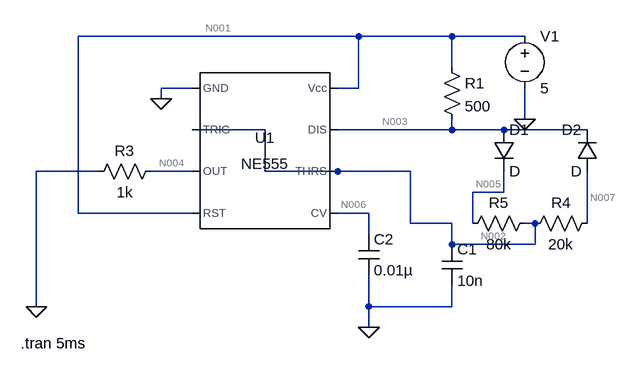
[diagram p0: schematic 555_sim.asc]
555_sim.asc, the LTspice schematic file:
Version 4
SHEET 1 880 680
WIRE 336 0 -96 0
WIRE 480 0 336 0
WIRE 592 0 480 0
WIRE 480 48 480 0
WIRE 80 80 32 80
WIRE 336 80 336 0
WIRE 336 80 304 80
WIRE 32 96 32 80
WIRE 592 128 592 80
WIRE 192 144 80 144
WIRE 480 144 480 128
WIRE 480 144 304 144
WIRE 560 144 480 144
WIRE 688 144 560 144
WIRE -64 208 -160 208
WIRE 80 208 16 208
WIRE 192 208 192 144
WIRE 304 208 192 208
WIRE 416 208 304 208
WIRE 560 240 560 208
WIRE 560 240 512 240
WIRE -96 272 -96 0
WIRE 80 272 -96 272
WIRE 352 272 304 272
WIRE 416 288 416 208
WIRE 480 288 416 288
WIRE 512 288 512 240
WIRE 608 288 592 288
WIRE 688 288 688 208
WIRE 352 304 352 272
WIRE 480 320 480 288
WIRE 608 320 608 288
WIRE 608 320 480 320
WIRE -160 416 -160 208
WIRE 352 416 352 368
WIRE 480 416 480 384
WIRE 480 416 352 416
WIRE 352 448 352 416
FLAG 592 128 0
FLAG -160 416 0
FLAG 352 448 0
FLAG 32 96 0
SYMBOL Misc\\NE555 192 176 R0
SYMATTR InstName U1
SYMBOL voltage 592 -16 R0
WINDOW 123 0 0 Left 0
WINDOW 39 0 0 Left 0
SYMATTR InstName V1
SYMATTR Value 5
SYMBOL res 464 32 R0
SYMATTR InstName R1
SYMATTR Value 500
SYMBOL cap 464 320 R0
SYMATTR InstName C1
SYMATTR Value 10n
SYMBOL cap 336 304 R0
SYMATTR InstName C2
SYMATTR Value 0.01µ
SYMBOL res 32 192 R90
WINDOW 0 0 56 VBottom 2
WINDOW 3 32 56 VTop 2
SYMATTR InstName R3
SYMATTR Value 1k
SYMBOL diode 544 144 R0
SYMATTR InstName D1
SYMBOL diode 704 208 R180
WINDOW 0 24 64 Left 2
WINDOW 3 24 0 Left 2
SYMATTR InstName D2
SYMBOL res 704 272 R90
WINDOW 0 0 56 VBottom 2
WINDOW 3 32 56 VTop 2
SYMATTR InstName R4
SYMATTR Value 20k
SYMBOL res 608 272 R90
WINDOW 0 0 56 VBottom 2
WINDOW 3 32 56 VTop 2
SYMATTR InstName R5
SYMATTR Value 80k
TEXT -184 472 Left 2 !.tran 5ms

The netlist it stands for:
* 555_sim.asc
XU1 0 N002 N004 N001 N006 N002 N003 N001 NE555  ; pins GND TRIG OUT RST CV THRS DIS Vcc
V1 N001 0 5
R1 N001 N003 500
C1 N002 0 10n
C2 N006 0 0.01µ
R3 N004 0 1k
D1 N003 N005 D
D2 N007 N003 D
R4 N007 N002 20k
R5 N002 N005 80k
.model D D
.lib standard.dio
.tran 5ms
.lib NE555.sub
.backanno
.end

* Results of the author's LTspice run, read from the files saved beside the schematic
* Operating Point, zero values left out:
*   V(n002) = 4.644 V
*   V(n006) = 3.333 V
*   V(n001) = 5 V
*   V(n003) = 5 V
*   V(n004) = 4.97 V
*   V(n005) = 4.645 V
*   V(n007) = 4.644 V
*   I(D1) = 9.289 nA
*   I(R5) = -9.287 nA
*   I(R3) = 4.97 mA
*   I(R1) = 15.96 nA
*   I(V1) = -6.581 mA
*   Ix(u1:1) = -1.611 mA
*   Ix(u1:2) = 4.644 nA
*   Ix(u1:3) = -4.97 mA
*   Ix(u1:4) = 22.67 µA
*   Ix(u1:6) = 4.644 nA
*   Ix(u1:7) = 6.672 nA
*   Ix(u1:8) = 6.558 mA
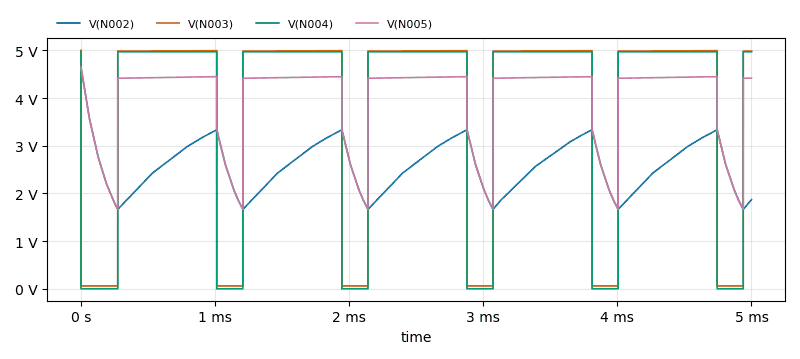
[diagram p1: Transient Analysis of 555_sim.asc, plotted from the saved traces]
* Transient Analysis, 1 run:
*   V(N002): min 1.665 V, max 4.644 V, average 2.569 V, rms 2.633 V, last 1.869 V
*   V(N003): min 59.59 mV, max 5 V, average 3.761 V, rms 4.323 V, last 4.984 V
*   V(N004): min 29.82 µV, max 4.972 V, average 3.732 V, rms 4.307 V, last 4.97 V
*   V(N005): min 1.665 V, max 4.645 V, average 3.947 V, rms 4.049 V, last 4.418 V